# EasyEDA Pro project RCkid.epro, schematic Cartridge V1

## Sheets
1 NRF24L01P: Create Date: 2023-09-16; Page Name: P1; Project Name: RCKid2; Schematic Name: Cartridge; Update Date: 2023-09-24; Company: EasyEDA.com; Drawed: EasyEDAPro; Page Size: A4; Part Number: JLCPCB-002; Reviewed: EasyEDAPro; Version: V0.1
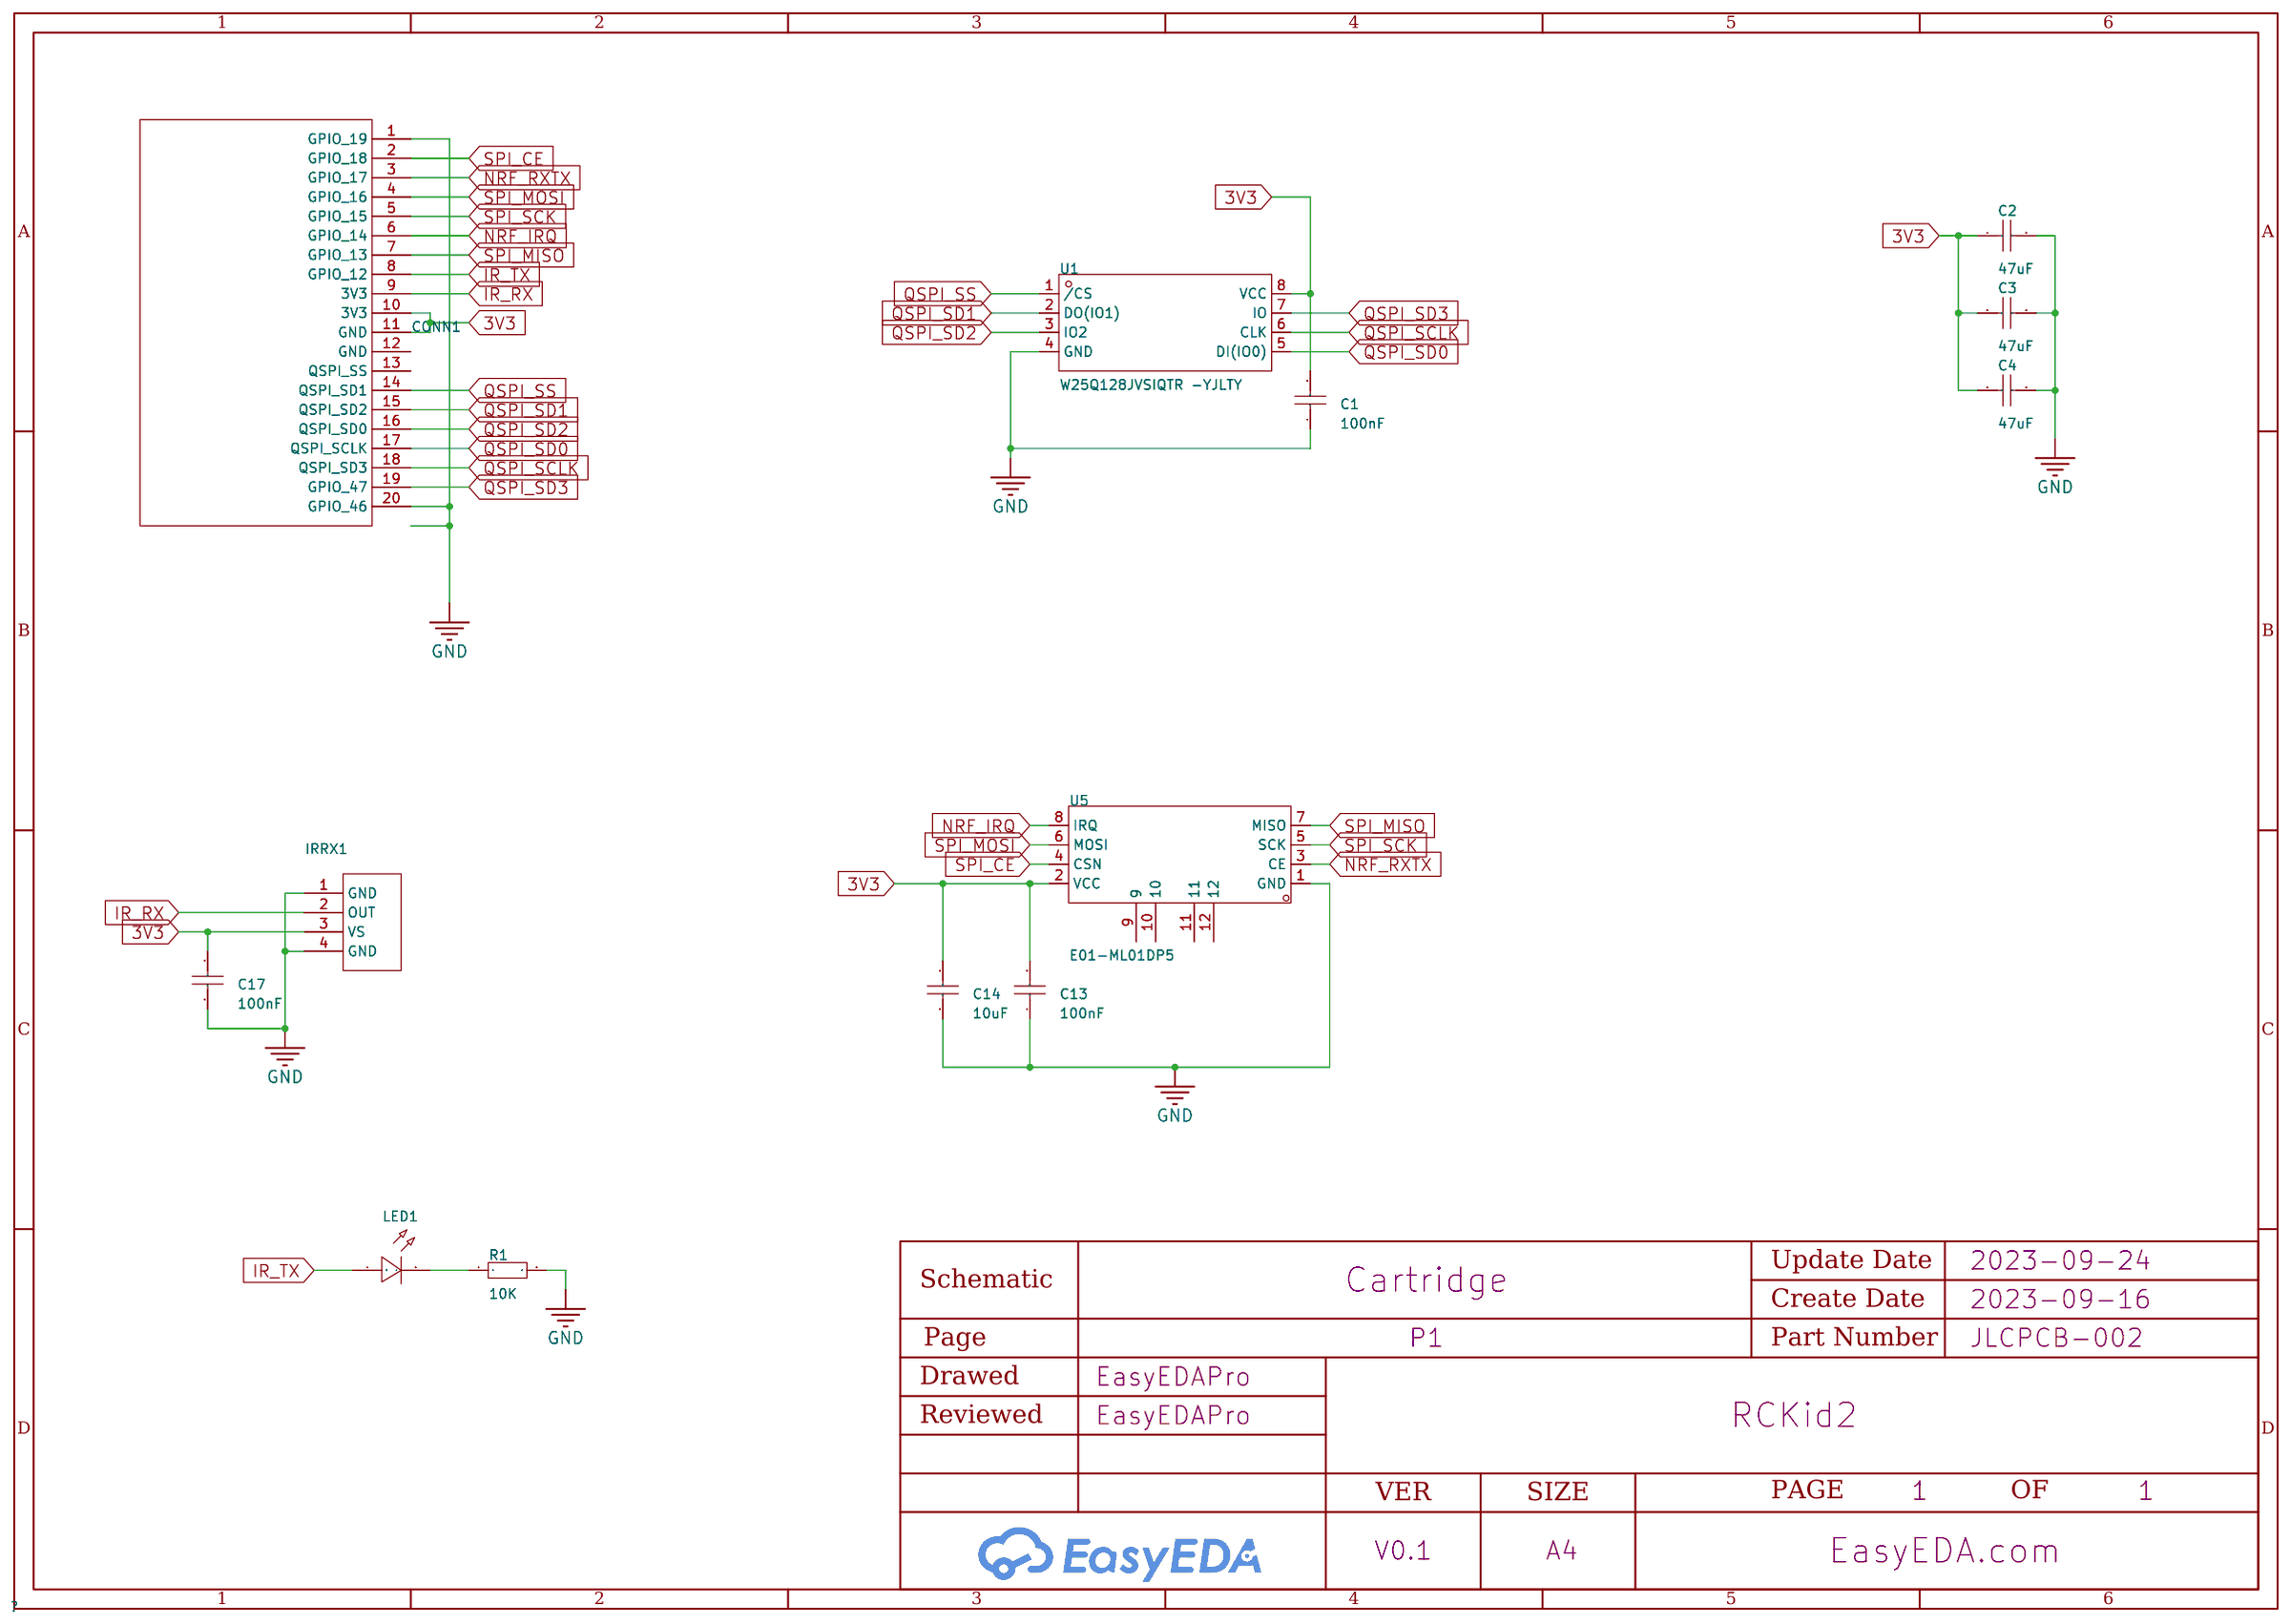
[diagram p0: NRF24L01P]
2 ESP12: Create Date: 2023-09-25; Page Name: ESP12; Update Date: 2023-09-25
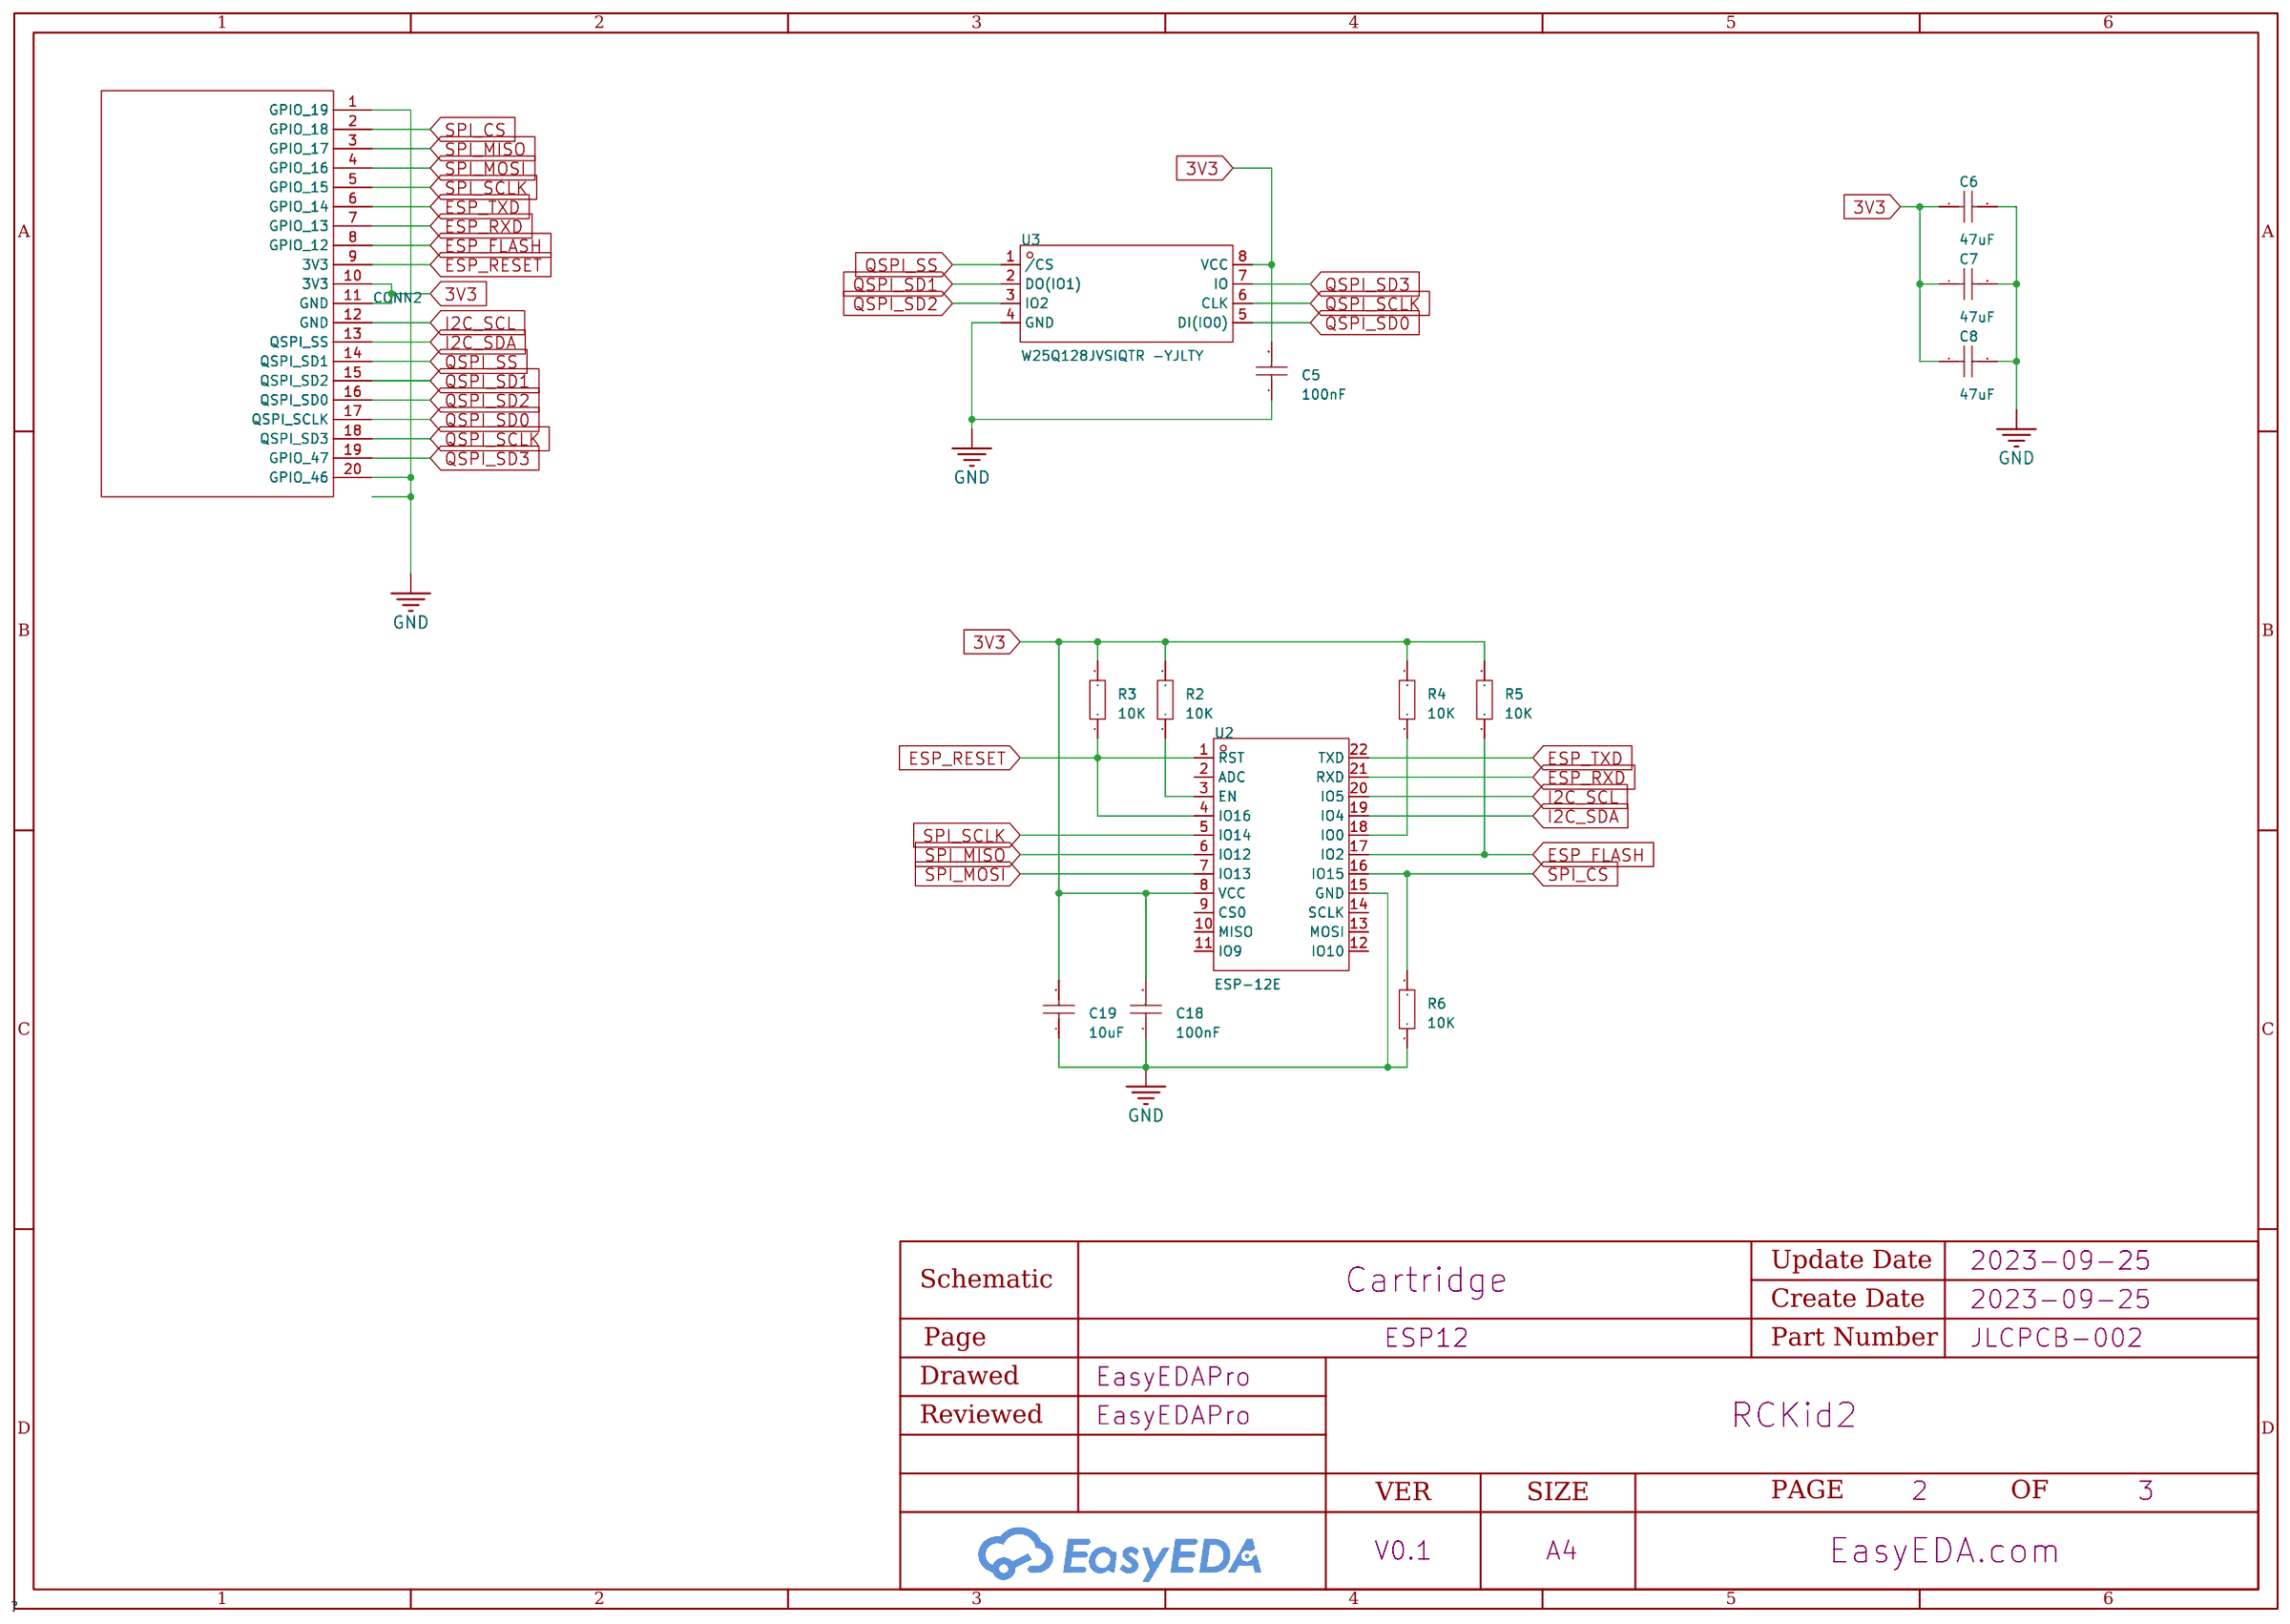
[diagram p1: ESP12]
3 XL1278: Create Date: 2023-09-25; Page Name: P3; Update Date: 2023-09-25
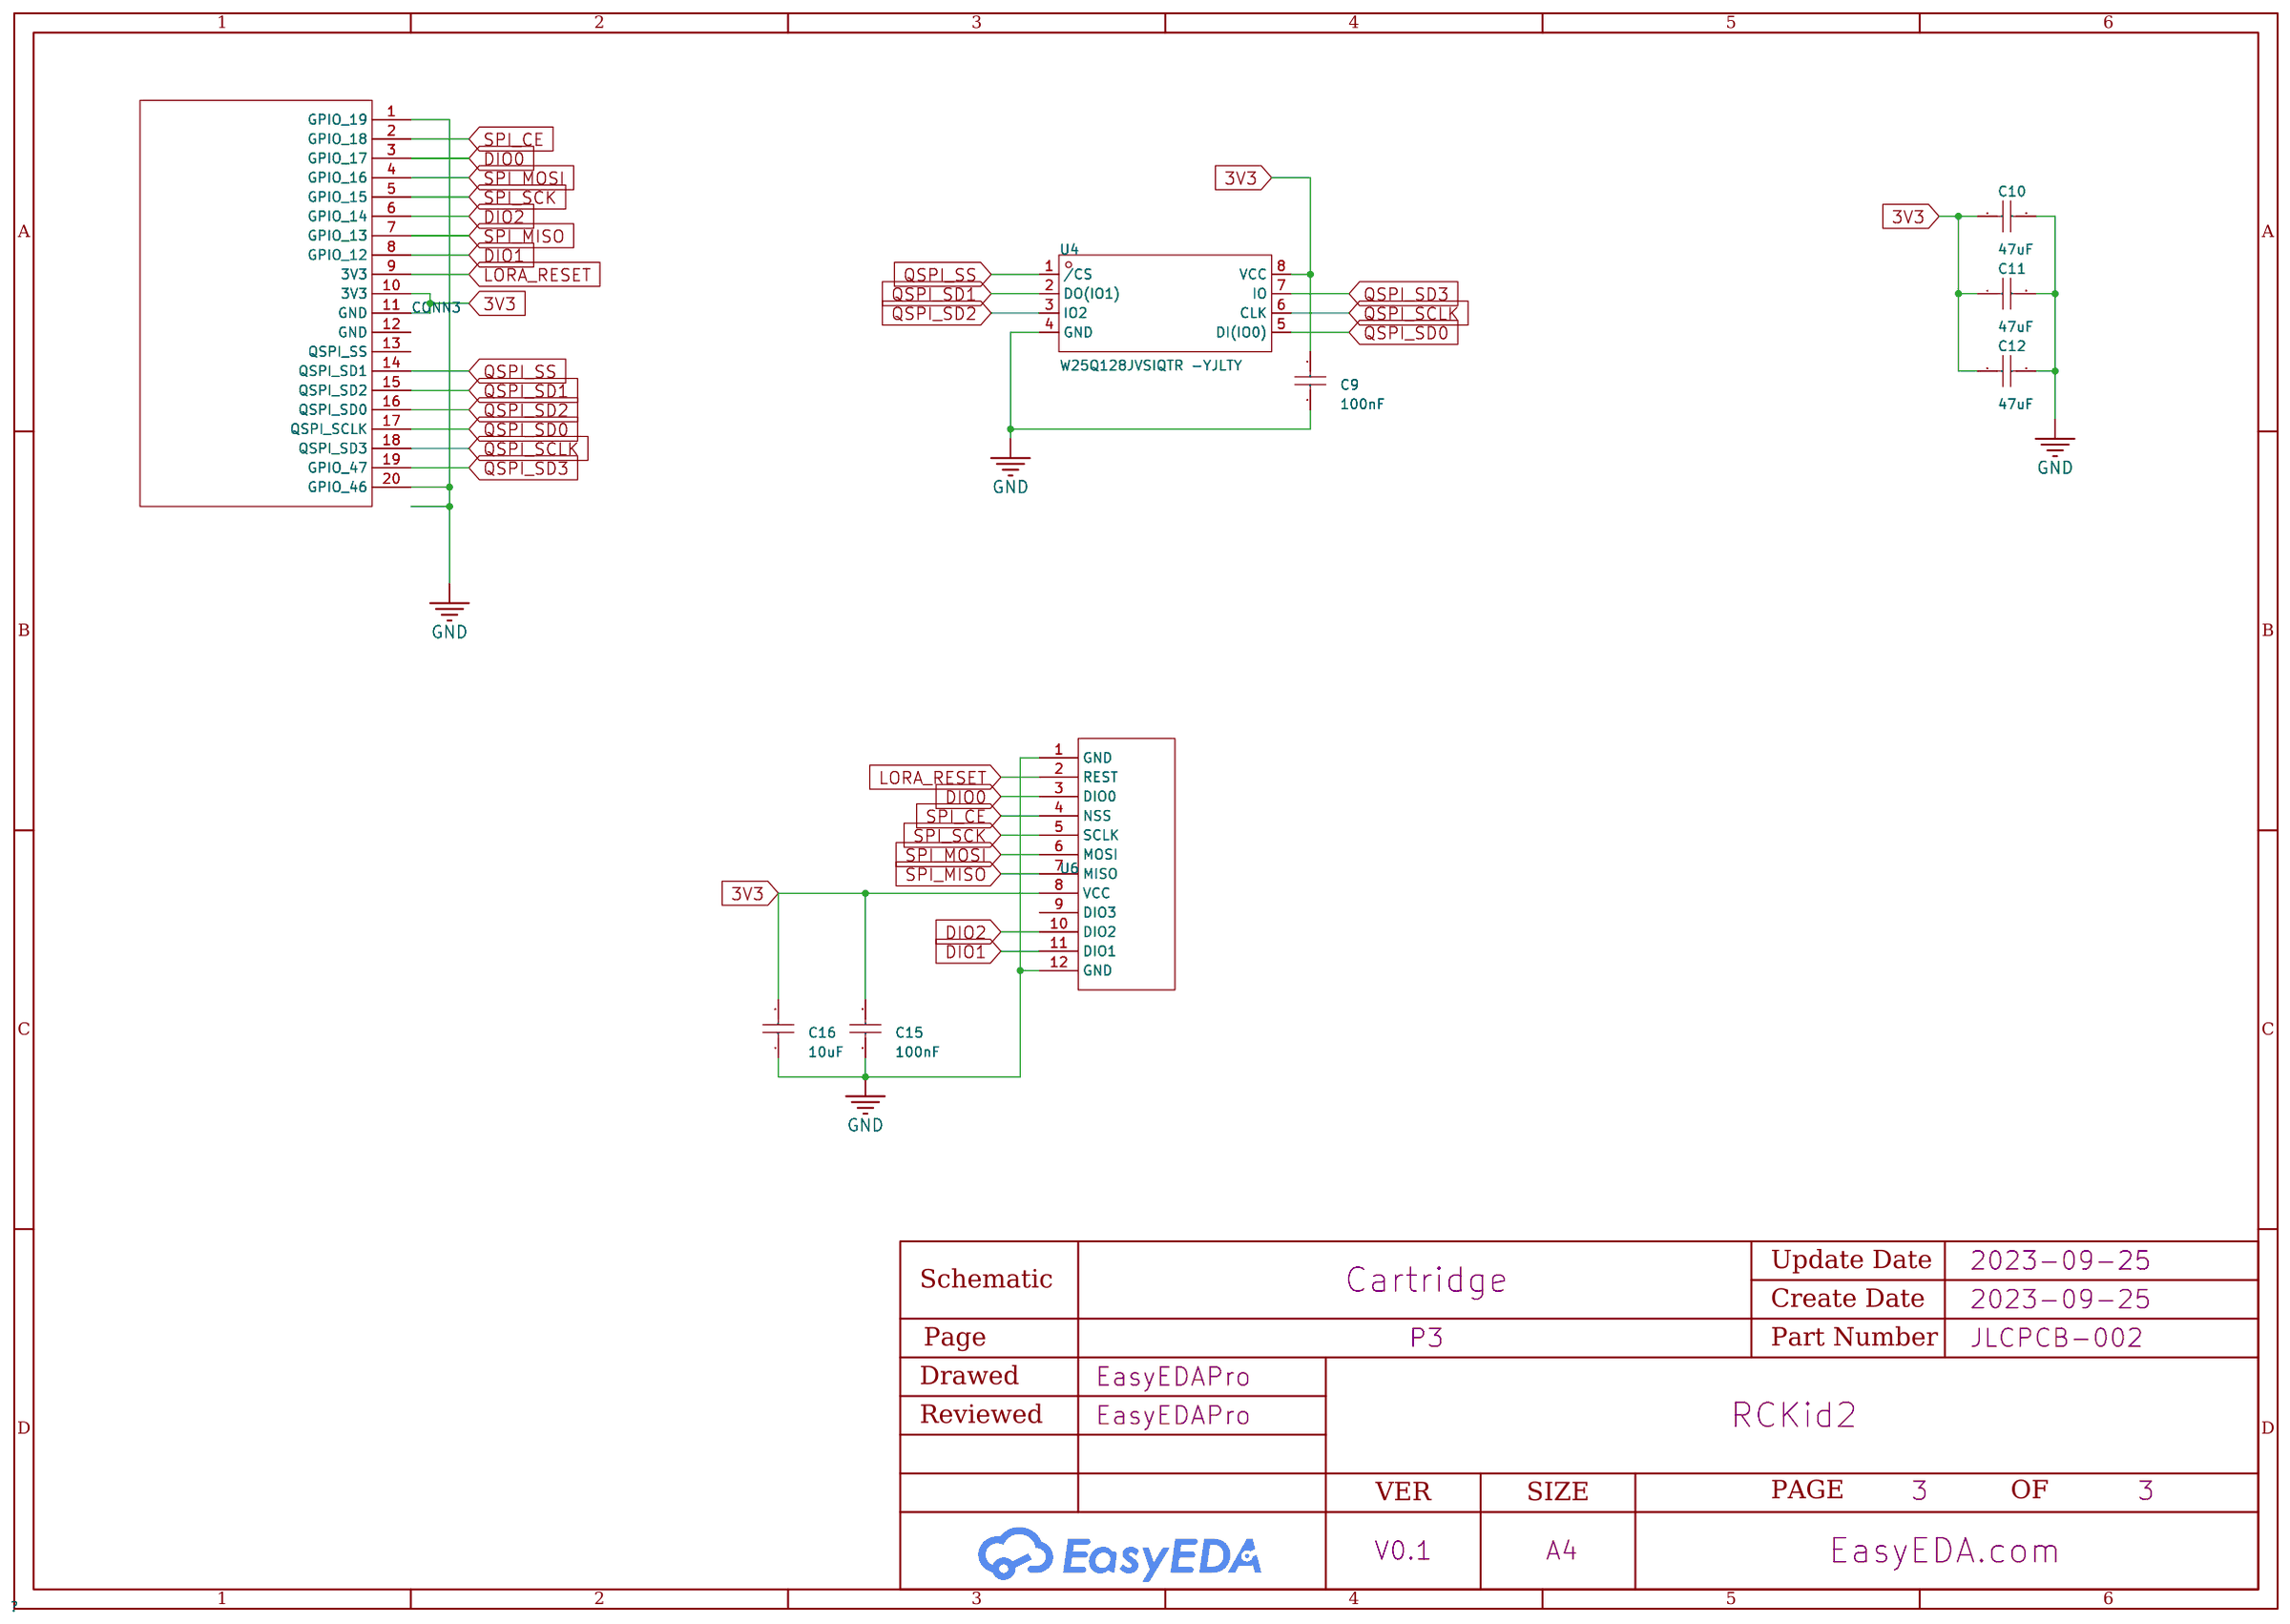
[diagram p2: XL1278]

## Parts
sheet ESP12
C5  100nF  [C0805]
C6  47uF  [C0805]
C7  47uF  [C0805]
C8  47uF  [C0805]
C18  100nF  [C0805]
C19  10uF  [C0805]
CONN2  -  [RCKid Cartridge Pins]
R2  10K  [R0805]
R3  10K  [R0805]
R4  10K  [R0805]
R5  10K  [R0805]
R6  10K  [R0805]
U2  ESP-12E  [WIFIM-SMD_ESP-12E-BR]
U3  W25Q128JVSIQTR -YJLTY  [SOIC-8_L5.3-W5.3-P1.27-LS8.0-BL]
sheet NRF24L01P
C1  100nF  [C0805]
C2  47uF  [C0805]
C3  47uF  [C0805]
C4  47uF  [C0805]
C13  100nF  [C0805]
C14  10uF  [C0805]
C17  100nF  [C0805]
CONN1  -  [RCKid Cartridge Pins]
IRRX1  -  [TSSP95038TR]
LED1  -  [LED-TH_BD3.0-P2.54-FD]
R1  10K  [R0805]
U1  W25Q128JVSIQTR -YJLTY  [SOIC-8_L5.3-W5.3-P1.27-LS8.0-BL]
U5  E01-ML01DP5  [WIRELM-TH_E01-ML01DP5]
sheet XL1278
C9  100nF  [C0805]
C10  47uF  [C0805]
C11  47uF  [C0805]
C12  47uF  [C0805]
C15  100nF  [C0805]
C16  10uF  [C0805]
CONN3  -  [RCKid Cartridge Pins]
U4  W25Q128JVSIQTR -YJLTY  [SOIC-8_L5.3-W5.3-P1.27-LS8.0-BL]
U6  -  [XL1278-SMT]

## Library data of the parts
C1 C5 C9 C13 C15 C17 C18 = CL21B104KCFNNNE: Capacitance: Tolerance:±10% Tolerance:±10% Voltage Rated: Temperature Coefficient:; LCSC Part Name: 100nF ±10% 100V; Supplier Part: C28233; Manufacturer: SAMSUNG(三星); Supplier Footprint: 0805; JLCPCB Part Class: Basic Part; Datasheet: https://atta.szlcsc.com/upload/public/pdf/source/20160103/1457707716102.pdf; Supplier: LCSC; Tolerance: ±10%
C2-C4 C6-C8 C10-C12 = CL21A476MQYNNNE: Capacitance: Tolerance:±20% Tolerance:±20% Voltage Rated: Temperature Coefficient:; LCSC Part Name: 47uF±20%6.3V; Supplier Part: C16780; Manufacturer: SAMSUNG(三星); Supplier Footprint: 0805; JLCPCB Part Class: BasicPart; Datasheet: https://atta.szlcsc.com/upload/public/pdf/source/20160103/1457707690276.pdf; Supplier: LCSC; Tolerance: ±20%
C14 C16 C19 = CL21A106KAYNNNE_C15850: Capacitance: Tolerance:±10% Tolerance:±10% Voltage Rated: Temperature Coefficient:; LCSC Part Name: 10uF ±10% 25V; Supplier Part: C15850; Manufacturer: SAMSUNG(三星); Manufacturer Part: CL21A106KAYNNNE; Supplier Footprint: 0805; JLCPCB Part Class: Basic Part; Datasheet: https://atta.szlcsc.com/upload/public/pdf/source/20160103/1457707679302.pdf; Supplier: LCSC; Tolerance: ±10%
CONN1-CONN3 = RCKid2 Cartridge Connector
R1-R6 = Res_0805: Supplier Footprint: 0805
U2 = ESP-12E: Supplier Part: C9900003842; Supplier Footprint: SMD; JLCPCB Part Class: Extended Part; Datasheet: https://atta.szlcsc.comnull; Supplier: LCSC
U1 U3 U4 = W25Q128JVSIQTR -YJLTY: LCSC Part Name: 串行闪存; Supplier Part: C2921483; Manufacturer: WINBOND(华邦); Supplier Footprint: SOIC-8-208mil; JLCPCB Part Class: Extended Part; Datasheet: 2021-11-15/642689F/b4c28fe9be624f43904f2fc1db378149/STM32F429IGT6.pdf; Supplier: LCSC
IRRX1 = TSSP95038TR
LED1 = LED_TH-R_3mm: Supplier Footprint: Through
U5 = E01-ML01DP5: Supplier Part: C97339; Manufacturer: EBYTE(亿佰特); JLCPCB Part Class: Extended Part; Supplier: LCSC
U6 = XL1278-SMT

## Nets
3V3: C1.2 C2.1 C3.1 C4.1 C5.2 C6.1 C7.1 C8.1 C9.2 C10.1 C11.1 C12.1 C13.2 C14.2 C15.2 C16.2 C17.2 C18.2 C19.2 CONN1.10(3V3) CONN1.11(GND) CONN2.10(3V3) CONN2.11(GND) CONN3.10(3V3) CONN3.11(GND) IRRX1.3(VS) R2.2 R3.2 R4.2 R5.2 U1.8(VCC) U2.8(VCC) U3.8(VCC) U4.8(VCC) U5.2(VCC) U6.8(VCC)
GND: C1.1 C2.2 C3.2 C4.2 C5.1 C6.2 C7.2 C8.2 C9.1 C10.2 C11.2 C12.2 C13.1 C14.1 C15.1 C16.1 C17.1 C18.1 C19.1 CONN1.1(GPIO_19) CONN1.20(GPIO_46) CONN2.1(GPIO_19) CONN2.20(GPIO_46) CONN3.1(GPIO_19) CONN3.20(GPIO_46) IRRX1.1(GND) IRRX1.4(GND) R1.2 R6.1 U1.4(GND) U2.15(GND) U3.4(GND) U4.4(GND) U5.1(GND) U6.1(GND) U6.12(GND)
DIO0: CONN3.3(GPIO_17) U6.3(DIO0)
DIO1: CONN3.8(GPIO_12) U6.11(DIO1)
DIO2: CONN3.6(GPIO_14) U6.10(DIO2)
ESP_FLASH: CONN2.8(GPIO_12) R5.1 U2.17(IO2)
ESP_RESET: CONN2.9(3V3) R3.1 U2.1(RST) U2.4(IO16)
ESP_RXD: CONN2.7(GPIO_13) U2.21(RXD)
ESP_TXD: CONN2.6(GPIO_14) U2.22(TXD)
I2C_SCL: CONN2.12(GND) U2.20(IO5)
I2C_SDA: CONN2.13(QSPI_SS) U2.19(IO4)
IR_RX: CONN1.9(3V3) IRRX1.2(OUT)
IR_TX: CONN1.8(GPIO_12) LED1.1(C)
LORA_RESET: CONN3.9(3V3) U6.2(REST)
NRF_IRQ: CONN1.6(GPIO_14) U5.8(IRQ)
NRF_RXTX: CONN1.3(GPIO_17) U5.3(CE)
QSPI_SCLK: CONN1.18(QSPI_SD3) CONN2.18(QSPI_SD3) CONN3.18(QSPI_SD3) U1.6(CLK) U3.6(CLK) U4.6(CLK)
QSPI_SD0: CONN1.17(QSPI_SCLK) CONN2.17(QSPI_SCLK) CONN3.17(QSPI_SCLK) U1.5(DI(IO0)) U3.5(DI(IO0)) U4.5(DI(IO0))
QSPI_SD1: CONN1.15(QSPI_SD2) CONN2.15(QSPI_SD2) CONN3.15(QSPI_SD2) U1.2(DO(IO1)) U3.2(DO(IO1)) U4.2(DO(IO1))
QSPI_SD2: CONN1.16(QSPI_SD0) CONN2.16(QSPI_SD0) CONN3.16(QSPI_SD0) U1.3(IO2) U3.3(IO2) U4.3(IO2)
QSPI_SD3: CONN1.19(GPIO_47) CONN2.19(GPIO_47) CONN3.19(GPIO_47) U1.7(IO) U3.7(IO) U4.7(IO)
QSPI_SS: CONN1.14(QSPI_SD1) CONN2.14(QSPI_SD1) CONN3.14(QSPI_SD1) U1.1(/CS) U3.1(/CS) U4.1(/CS)
SPI_CE: CONN1.2(GPIO_18) CONN3.2(GPIO_18) U5.4(CSN) U6.4(NSS)
SPI_CS: CONN2.2(GPIO_18) R6.2 U2.16(IO15)
SPI_MISO: CONN1.7(GPIO_13) CONN2.3(GPIO_17) CONN3.7(GPIO_13) U2.6(IO12) U5.7(MISO) U6.7(MISO)
SPI_MOSI: CONN1.4(GPIO_16) CONN2.4(GPIO_16) CONN3.4(GPIO_16) U2.7(IO13) U5.6(MOSI) U6.6(MOSI)
SPI_SCK: CONN1.5(GPIO_15) CONN3.5(GPIO_15) U5.5(SCK) U6.5(SCLK)
SPI_SCLK: CONN2.5(GPIO_15) U2.5(IO14)
$1N2752: LED1.2(A) R1.1
$2N955: R2.1 U2.3(EN)
$2N1029: R4.1 U2.18(IO0)

Not connected (* = marked no-connect by the designer): CONN1 12(GND) 13(QSPI_SS); CONN3 12(GND) 13(QSPI_SS); U2 2(ADC) 9(CS0) 10(MISO) 11(IO9) 12(IO10) 13(MOSI) 14(SCLK); U5 9 10 11 12; U6 9(DIO3)
